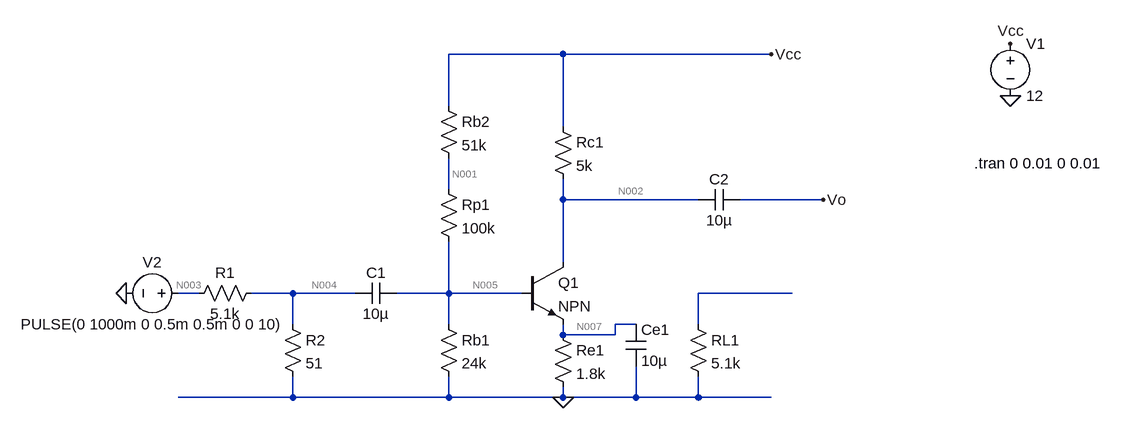
[diagram p0: schematic Experiment2_3_1.asc]
Experiment2_3_1.asc, the LTspice schematic file:
Version 4.1
SHEET 1 952 680
WIRE 80 -144 -96 -144
WIRE 400 -144 80 -144
WIRE -96 -64 -96 -144
WIRE 80 -32 80 -144
WIRE -96 64 -96 16
WIRE 80 80 80 48
WIRE 288 80 80 80
WIRE 480 80 352 80
WIRE 80 176 80 80
WIRE -480 224 -512 224
WIRE -336 224 -400 224
WIRE -240 224 -336 224
WIRE -96 224 -96 144
WIRE -96 224 -176 224
WIRE 16 224 -96 224
WIRE 432 224 288 224
WIRE -336 272 -336 224
WIRE -96 272 -96 224
WIRE 192 272 160 272
WIRE 288 272 288 224
WIRE 80 288 80 272
WIRE 160 288 160 272
WIRE 160 288 80 288
WIRE -336 384 -336 352
WIRE -336 384 -512 384
WIRE -96 384 -96 352
WIRE -96 384 -336 384
WIRE 80 384 80 368
WIRE 80 384 -96 384
WIRE 192 384 192 336
WIRE 192 384 80 384
WIRE 288 384 288 352
WIRE 288 384 192 384
WIRE 400 384 288 384
FLAG 80 384 0
FLAG 400 -144 Vcc
FLAG 768 -160 Vcc
FLAG 768 -80 0
FLAG 480 80 Vo
FLAG -592 224 0
SYMBOL res -384 208 R90
WINDOW 0 0 56 VBottom 2
WINDOW 3 32 56 VTop 2
SYMATTR InstName R1
SYMATTR Value 5.1k
SYMBOL res -352 256 R0
SYMATTR InstName R2
SYMATTR Value 51
SYMBOL res -112 256 R0
SYMATTR InstName Rb1
SYMATTR Value 24k
SYMBOL res -112 48 R0
SYMATTR InstName Rp1
SYMATTR Value 100k
SYMBOL res -112 -80 R0
SYMATTR InstName Rb2
SYMATTR Value 51k
SYMBOL npn 16 176 R0
SYMATTR InstName Q1
SYMBOL res 64 272 R0
SYMATTR InstName Re1
SYMATTR Value 1.8k
SYMBOL res 272 256 R0
SYMATTR InstName RL1
SYMATTR Value 5.1k
SYMBOL res 64 -48 R0
SYMATTR InstName Rc1
SYMATTR Value 5k
SYMBOL voltage 768 -176 R0
WINDOW 123 0 0 Left 0
WINDOW 39 0 0 Left 0
SYMATTR InstName V1
SYMATTR Value 12
SYMBOL cap -176 208 R90
WINDOW 0 0 32 VBottom 2
WINDOW 3 32 32 VTop 2
SYMATTR InstName C1
SYMATTR Value 10µ
SYMATTR SpiceLine V=6.3 Irms=0 Rser=4 Lser=0 mfg="AVX" pn="TAJA106M006" type="Tantalum"
SYMBOL cap 288 96 R270
WINDOW 0 32 32 VTop 2
WINDOW 3 0 32 VBottom 2
SYMATTR InstName C2
SYMATTR Value 10µ
SYMATTR SpiceLine V=6.3 Irms=0 Rser=4 Lser=0 mfg="AVX" pn="TAJA106M006" type="Tantalum"
SYMBOL cap 176 272 R0
SYMATTR Value 10µ
SYMATTR InstName Ce1
SYMATTR SpiceLine V=6.3 Irms=0 Rser=4 Lser=0 mfg="AVX" pn="TAJA106M006" type="Tantalum"
SYMBOL voltage -496 224 R90
WINDOW 0 -32 56 VBottom 2
WINDOW 3 32 56 VTop 2
WINDOW 123 0 0 Left 0
WINDOW 39 0 0 Left 0
SYMATTR InstName V2
SYMATTR Value PULSE(0 1000m 0 0.5m 0.5m 0 0 10)
TEXT 712 24 Left 2 !.tran 0 0.01 0 0.01

The netlist it stands for:
* Experiment2_3_1.asc
R1 N004 N003 5.1k
R2 N004 0 51
Rb1 N005 0 24k
Rp1 N001 N005 100k
Rb2 Vcc N001 51k
Q1 N002 N005 N007 0 NPN
Re1 N007 0 1.8k
RL1 N006 0 5.1k
Rc1 Vcc N002 5k
V1 Vcc 0 12
C1 N005 N004 10µ V=6.3 Irms=0 Rser=4 Lser=0 mfg="AVX" pn="TAJA106M006" type="Tantalum"
C2 N002 Vo 10µ V=6.3 Irms=0 Rser=4 Lser=0 mfg="AVX" pn="TAJA106M006" type="Tantalum"
Ce1 N007 0 10µ V=6.3 Irms=0 Rser=4 Lser=0 mfg="AVX" pn="TAJA106M006" type="Tantalum"
V2 N003 0 PULSE(0 1000m 0 0.5m 0.5m 0 0 10)
.model NPN NPN
.model PNP PNP
.lib standard.bjt
.tran 0 0.01 0 0.01
.backanno
.end

* Results of the author's LTspice run, read from the files saved beside the schematic
* Operating Point, zero values left out:
*   V(n001) = 8.472 V
*   V(vcc) = 12 V
*   V(n007) = 801.4 mV
*   V(n005) = 1.554 V
*   V(n002) = 9.796 V
*   V(vo) = 9.796 V
*   Ic(Q1) = 440.8 µA
*   Ib(Q1) = 4.408 µA
*   Ie(Q1) = -445.2 µA
*   I(Rb1) = 64.77 µA
*   I(Rb2) = 69.18 µA
*   I(Rp1) = 69.18 µA
*   I(Re1) = 445.2 µA
*   I(V1) = -510 µA
*   I(Rc1) = 440.8 µA
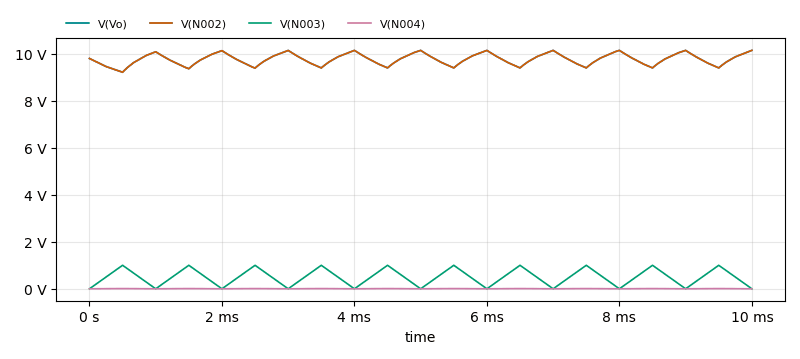
[diagram p1: Transient Analysis of Experiment2_3_1.asc, plotted from the saved traces]
* Transient Analysis, 1 run:
*   V(Vo): min 9.21 V, max 10.14 V, average 9.762 V, rms 9.765 V, last 10.14 V
*   V(N002): min 9.21 V, max 10.14 V, average 9.762 V, rms 9.765 V, last 10.14 V
*   V(N003): min 0 V, max 1 V, average 500 mV, rms 593 mV, last 0 V
*   V(N004): min 0 V, max 9.837 mV, average 4.935 mV, rms 5.842 mV, last 35.51 µV